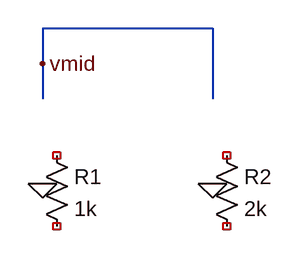
[diagram p0: schematic label_on_vertical_wire_interior.asc]
label_on_vertical_wire_interior.asc, the LTspice schematic file:
Version 4
SHEET 1 880 680
WIRE 96 16 96 96
WIRE 96 16 288 16
WIRE 288 16 288 96
SYMBOL res 96 144 R0
SYMATTR InstName R1
SYMATTR Value 1k
SYMBOL res 288 144 R0
SYMATTR InstName R2
SYMATTR Value 2k
FLAG 96 192 0
FLAG 288 192 0
FLAG 96 56 vmid

The netlist it stands for:
* label_on_vertical_wire_interior.asc
R1 NC_01 NC_02 1k
R2 NC_03 NC_04 2k
.backanno
.end